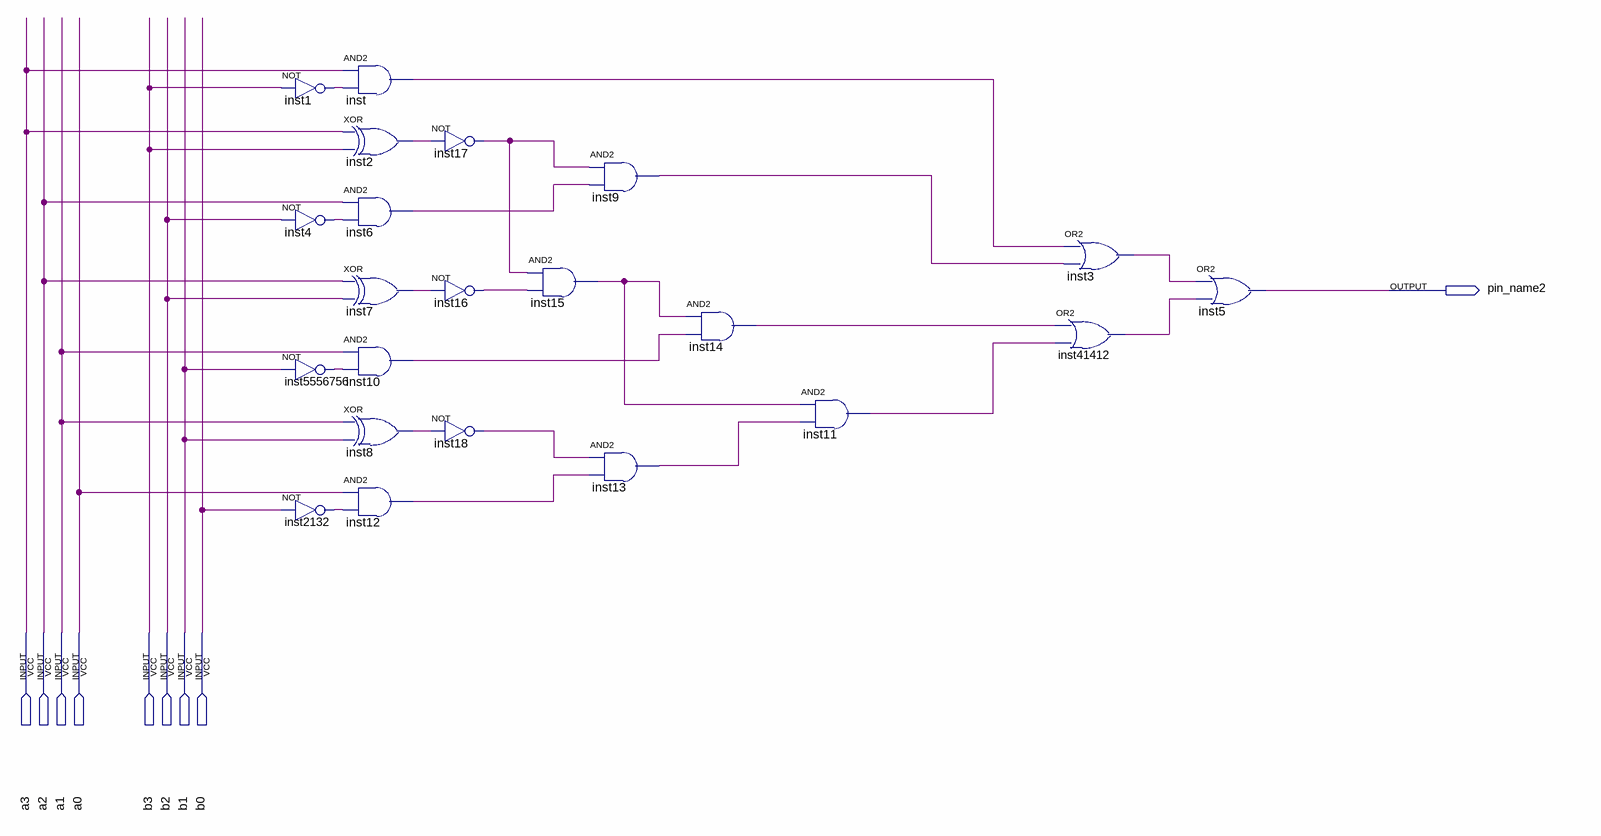
[diagram p0: schematic sheet]
// Quartus schematic comparador_modular.bdf as structural Verilog: 22 symbols, 9 pins
module comparador_modular (
  input  a3,
  input  a2,
  input  a1,
  input  a0,
  input  b3,
  input  b2,
  input  b1,
  input  b0,
  output pin_name2
);

  wire inst1_out, inst2_out, inst3_out, inst4_out, inst6_out, inst7_out, inst8_out, inst9_out, inst10_out,
       inst11_out, inst12_out, inst13_out, inst14_out, inst15_out, inst16_out, inst17_out, inst18_out,
       inst2132_out, inst41412_out, inst5556756_out, inst_out;

  not inst1 (inst1_out, b3);
  not inst4 (inst4_out, b2);
  not inst5556756 (inst5556756_out, b1);
  not inst2132 (inst2132_out, b0);
  and inst (inst_out, a3, inst1_out);
  xor inst2 (inst2_out, a3, b3);
  and inst6 (inst6_out, a2, inst4_out);
  xor inst7 (inst7_out, a2, b2);
  and inst10 (inst10_out, a1, inst5556756_out);
  xor inst8 (inst8_out, a1, b1);
  and inst12 (inst12_out, a0, inst2132_out);
  not inst17 (inst17_out, inst2_out);
  not inst16 (inst16_out, inst7_out);
  not inst18 (inst18_out, inst8_out);
  and inst15 (inst15_out, inst17_out, inst16_out);
  and inst9 (inst9_out, inst17_out, inst6_out);
  and inst13 (inst13_out, inst18_out, inst12_out);
  and inst14 (inst14_out, inst15_out, inst10_out);
  and inst11 (inst11_out, inst15_out, inst13_out);
  or inst3 (inst3_out, inst_out, inst9_out);
  or inst41412 (inst41412_out, inst14_out, inst11_out);
  or inst5 (pin_name2, inst3_out, inst41412_out);
endmodule
